# EAGLE design Breakoutboardv1 (EAGLE 6.6.0)

## Sheet 1 of 2
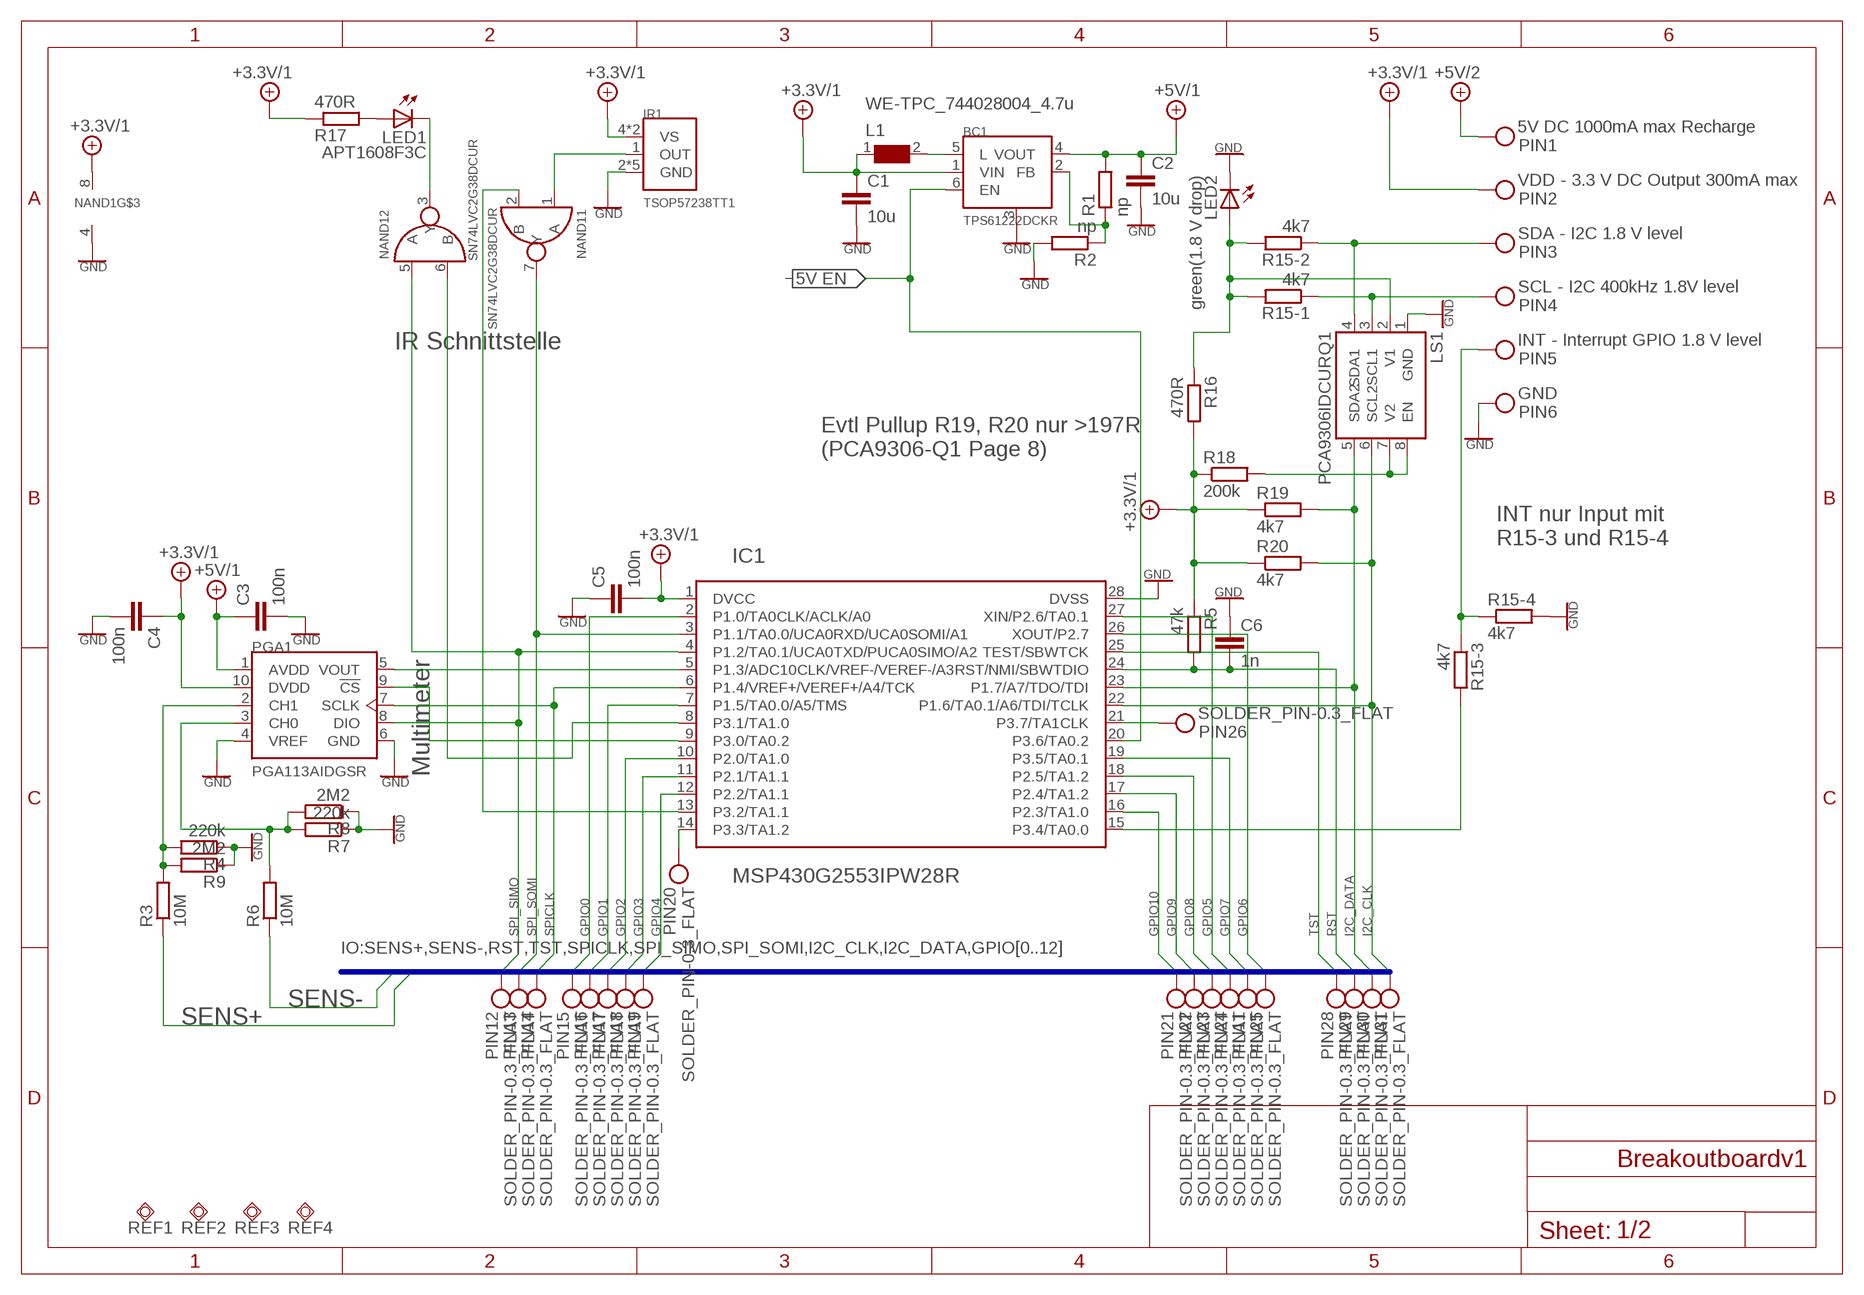
[diagram p0: schematic, sheet 1]

### Parts
BC1  TPS61222DCKR  [SOP65P210X110-6L]
C1  10u  C-EUC0805N  [CAPC2012X95N]
C2  10u  C-EUC0805N  [CAPC2012X95N]
C3  100n  C-EUC0603L  [CAPC1608X90L]
C4  100n  C-EUC0603L  [CAPC1608X90L]
C5  100n  C-EUC0603L  [CAPC1608X90L]
C6  1n  C-EUC0603L  [CAPC1608X90L]
IC1  MSP430G2553IPW28R  [SOP65P640X120-28L]
IR1  TSOP57238TT1  [TSOP572]
L1  WE-TPC_744028004_4.7u  WE-TPC_2811/2813  [WE-TPC_2811/2813]
LED1  APT1608F3C  LED0603  [LED-0603]
LED2  green(1.8 V drop)  LED0603  [LED-0603]
LS1  PCA9306IDCURQ1  [SOP50P310X90-8L]
NAND1  SN74LVC2G38DCUR  [SOP50P310X90-8L]
PGA1  PGA113AIDGSR  [SOP50P490X110-10L]
PIN1  5V DC 1000mA max Recharge  SOLDER_PIN-1.0_FLAT  [SOLDER_PIN_1_FLAT]
PIN2  VDD - 3.3 V DC Output 300mA max  SOLDER_PIN-1.0_FLAT  [SOLDER_PIN_1_FLAT]
PIN3  SDA - I2C 1.8 V level  SOLDER_PIN-1.0_FLAT  [SOLDER_PIN_1_FLAT]
PIN4  SCL - I2C 400kHz 1.8V level  SOLDER_PIN-1.0_FLAT  [SOLDER_PIN_1_FLAT]
PIN5  INT - Interrupt GPIO 1.8 V level  SOLDER_PIN-1.0_FLAT  [SOLDER_PIN_1_FLAT]
PIN6  GND  SOLDER_PIN-1.0_FLAT  [SOLDER_PIN_1_FLAT]
PIN11  SOLDER_PIN-0.3_FLAT  [SOLDER_PIN_0.3_FLAT]
PIN12  SOLDER_PIN-0.3_FLAT  [SOLDER_PIN_0.3_FLAT]
PIN13  SOLDER_PIN-0.3_FLAT  [SOLDER_PIN_0.3_FLAT]
PIN14  SOLDER_PIN-0.3_FLAT  [SOLDER_PIN_0.3_FLAT]
PIN15  SOLDER_PIN-0.3_FLAT  [SOLDER_PIN_0.3_FLAT]
PIN16  SOLDER_PIN-0.3_FLAT  [SOLDER_PIN_0.3_FLAT]
PIN17  SOLDER_PIN-0.3_FLAT  [SOLDER_PIN_0.3_FLAT]
PIN18  SOLDER_PIN-0.3_FLAT  [SOLDER_PIN_0.3_FLAT]
PIN19  SOLDER_PIN-0.3_FLAT  [SOLDER_PIN_0.3_FLAT]
PIN20  SOLDER_PIN-0.3_FLAT  [SOLDER_PIN_0.3_FLAT]
PIN21  SOLDER_PIN-0.3_FLAT  [SOLDER_PIN_0.3_FLAT]
PIN22  SOLDER_PIN-0.3_FLAT  [SOLDER_PIN_0.3_FLAT]
PIN23  SOLDER_PIN-0.3_FLAT  [SOLDER_PIN_0.3_FLAT]
PIN24  SOLDER_PIN-0.3_FLAT  [SOLDER_PIN_0.3_FLAT]
PIN25  SOLDER_PIN-0.3_FLAT  [SOLDER_PIN_0.3_FLAT]
PIN26  SOLDER_PIN-0.3_FLAT  [SOLDER_PIN_0.3_FLAT]
PIN28  SOLDER_PIN-0.3_FLAT  [SOLDER_PIN_0.3_FLAT]
PIN29  SOLDER_PIN-0.3_FLAT  [SOLDER_PIN_0.3_FLAT]
PIN30  SOLDER_PIN-0.3_FLAT  [SOLDER_PIN_0.3_FLAT]
PIN31  SOLDER_PIN-0.3_FLAT  [SOLDER_PIN_0.3_FLAT]
R1  np  R-EU-R0603L  [RESC1608X45L]
R2  np  R-EU-R0603L  [RESC1608X45L]
R3  10M  R-EU-R0603L  [RESC1608X45L]
R4  220k  R-EU-R0603L  [RESC1608X45L]
R5  47k  R-EU-R0603L  [RESC1608X45L]
R6  10M  R-EU-R0603L  [RESC1608X45L]
R7  220k  R-EU-R0603L  [RESC1608X45L]
R8  2M2  R-EU-R0603L  [RESC1608X45L]
R9  2M2  R-EU-R0603L  [RESC1608X45L]
R15  4k7  CTS-74,2C083  [R_ARRAY_742]
R16  470R  R-EU-R0603L  [RESC1608X45L]
R17  470R  R-EU-R0603L  [RESC1608X45L]
R18  200k  R-EU-R0603L  [RESC1608X45L]
R19  4k7  R-EU-R0603L  [RESC1608X45L]
R20  4k7  R-EU-R0603L  [RESC1608X45L]
REF1  PCB-REF-1.27  [PCB-REF]
REF2  PCB-REF-1.27  [PCB-REF]
REF3  PCB-REF-1.27  [PCB-REF]
REF4  PCB-REF-1.27  [PCB-REF]

### Nets
5VEN: BC1.6(EN) IC1.20(P3.6/TA0.2)
+3.3V/1: BC1.1(VIN) C1.1 C4.1 C5.2 IC1.1(DVCC) IR1.4(VS) IR1.5(VS) L1.1 NAND1.8(VDD) PGA1.10(DVDD) PIN2._(PIN) R5.1 R16.2 R17.1 R18.1 R19.1 R20.1 ; also sheet 2
+5V/1: BC1.4(VOUT) C2.1 C3.1 PGA1.1(AVDD) R1.2 ; also sheet 2
+5V/2: PIN1._(PIN) ; also sheet 2
CS_PGA: IC1.9(P3.0/TA0.2) PGA1.9(!CS)
GND: BC1.3(GND) C1.2 C2.2 C3.2 C4.2 C5.1 C6.1 IC1.28(DVSS) IR1.2(GND) IR1.3(GND) IR1.6(GND) IR1.7(GND) IR1.8(GND) LED2.C LS1.1(GND) NAND1.4(GND) PGA1.4(VREF) PGA1.6(GND) PIN6._(PIN) R2.2 R4.1 R7.1 R8.1 R9.1 R15.5 ; also sheet 2
GPIO0: IC1.2(P1.0/TA0CLK/ACLK/A0) PIN15._(PIN) ; also sheet 2
GPIO1: IC1.7(P1.5/TA0.0/A5/TMS) PIN16._(PIN) ; also sheet 2
GPIO2: IC1.10(P2.0/TA1.0) PIN17._(PIN) ; also sheet 2
GPIO3: IC1.11(P2.1/TA1.1) PIN18._(PIN) ; also sheet 2
GPIO4: IC1.12(P2.2/TA1.1) PIN19._(PIN) ; also sheet 2
GPIO5: IC1.27(XIN/P2.6/TA0.1) PIN24._(PIN) ; also sheet 2
GPIO6: IC1.26(XOUT/P2.7) PIN25._(PIN) ; also sheet 2
GPIO7: IC1.19(P3.5/TA0.1) PIN11._(PIN) ; also sheet 2
GPIO8: IC1.18(P2.5/TA1.2) PIN23._(PIN) ; also sheet 2
GPIO9: IC1.17(P2.4/TA1.2) PIN22._(PIN) ; also sheet 2
GPIO10: IC1.16(P2.3/TA1.0) PIN21._(PIN) ; also sheet 2
I2C_CLK: IC1.22(P1.6/TA0.1/A6/TDI/TCLK) LS1.6(SCL2) PIN31._(PIN) R20.2 ; also sheet 2
I2C_DATA: IC1.23(P1.7/A7/TDO/TDI) LS1.5(SDA2) PIN30._(PIN) R19.2 ; also sheet 2
INT_JOLLA: IC1.15(P3.4/TA0.0) R15.6
IR-R_CONT: IC1.13(P3.2/TA1.1) NAND1.2(1:B)
IR-T_CONT: IC1.8(P3.1/TA1.0) NAND1.6(2:B)
N$1: BC1.2(FB) R1.1 R2.1
N$2: BC1.5(L) L1.2
N$4: PGA1.2(CH1) R3.2 R4.2 R9.2
N$6: IC1.14(P3.3/TA1.2) PIN20._(PIN)
N$7: PGA1.3(CH0) R6.2 R7.2 R8.2
N$17: IC1.21(P3.7/TA1CLK) PIN26._(PIN)
N$18: LED1.A R17.2
N$19: PIN5._(PIN) R15.3 R15.4
N$21: LED2.A LS1.2(V1) R15.7 R15.8 R16.1
N$38: IR1.1(OUT) NAND1.1(1:A)
N$39: LED1.C NAND1.3(2:Y)
N$40: LS1.4(SDA1) PIN3._(PIN) R15.2
N$42: LS1.7(V2) LS1.8(EN) R18.2
N$43: LS1.3(SCL1) PIN4._(PIN) R15.1
RST: C6.2 IC1.24(RST/NMI/SBWTDIO) PIN29._(PIN) R5.2 ; also sheet 2
SENS+ [sens]: R3.1 ; also sheet 2
SENS- [sens]: R6.1 ; also sheet 2
SPI_SIMO: IC1.4(P1.2/TA0.1/UCA0TXD/PUCA0SIMO/A2) NAND1.5(2:A) PGA1.8(DIO) PIN12._(PIN) ; also sheet 2
SPI_SOMI: IC1.3(P1.1/TA0.0/UCA0RXD/UCA0SOMI/A1) NAND1.7(1:Y) PIN13._(PIN) ; also sheet 2
SPICLK: IC1.6(P1.4/VREF+/VEREF+/A4/TCK) PGA1.7(SCLK) PIN14._(PIN) ; also sheet 2
TST: IC1.25(TEST/SBWTCK) PIN28._(PIN) ; also sheet 2
VAD_SENSE: IC1.5(P1.3/ADC10CLK/VREF-/VEREF-/A3) PGA1.5(VOUT)
Unconnected: REF1.0(PP) REF2.0(PP) REF3.0(PP) REF4.0(PP)

### Buses
IO:SENS+,SENS-,RST,TST,SPICLK,SPI_SIMO,SPI_SOMI,I2C_CLK,I2C_DATA,GPIO[0..12]

### Notes on the sheet
- IR Schnittstelle
- Evtl Pullup R19, R20 nur >197R
  (PCA9306-Q1 Page 8)
- INT nur Input mit
  R15-3 und R15-4
- Multimeter

## Sheet 2 of 2
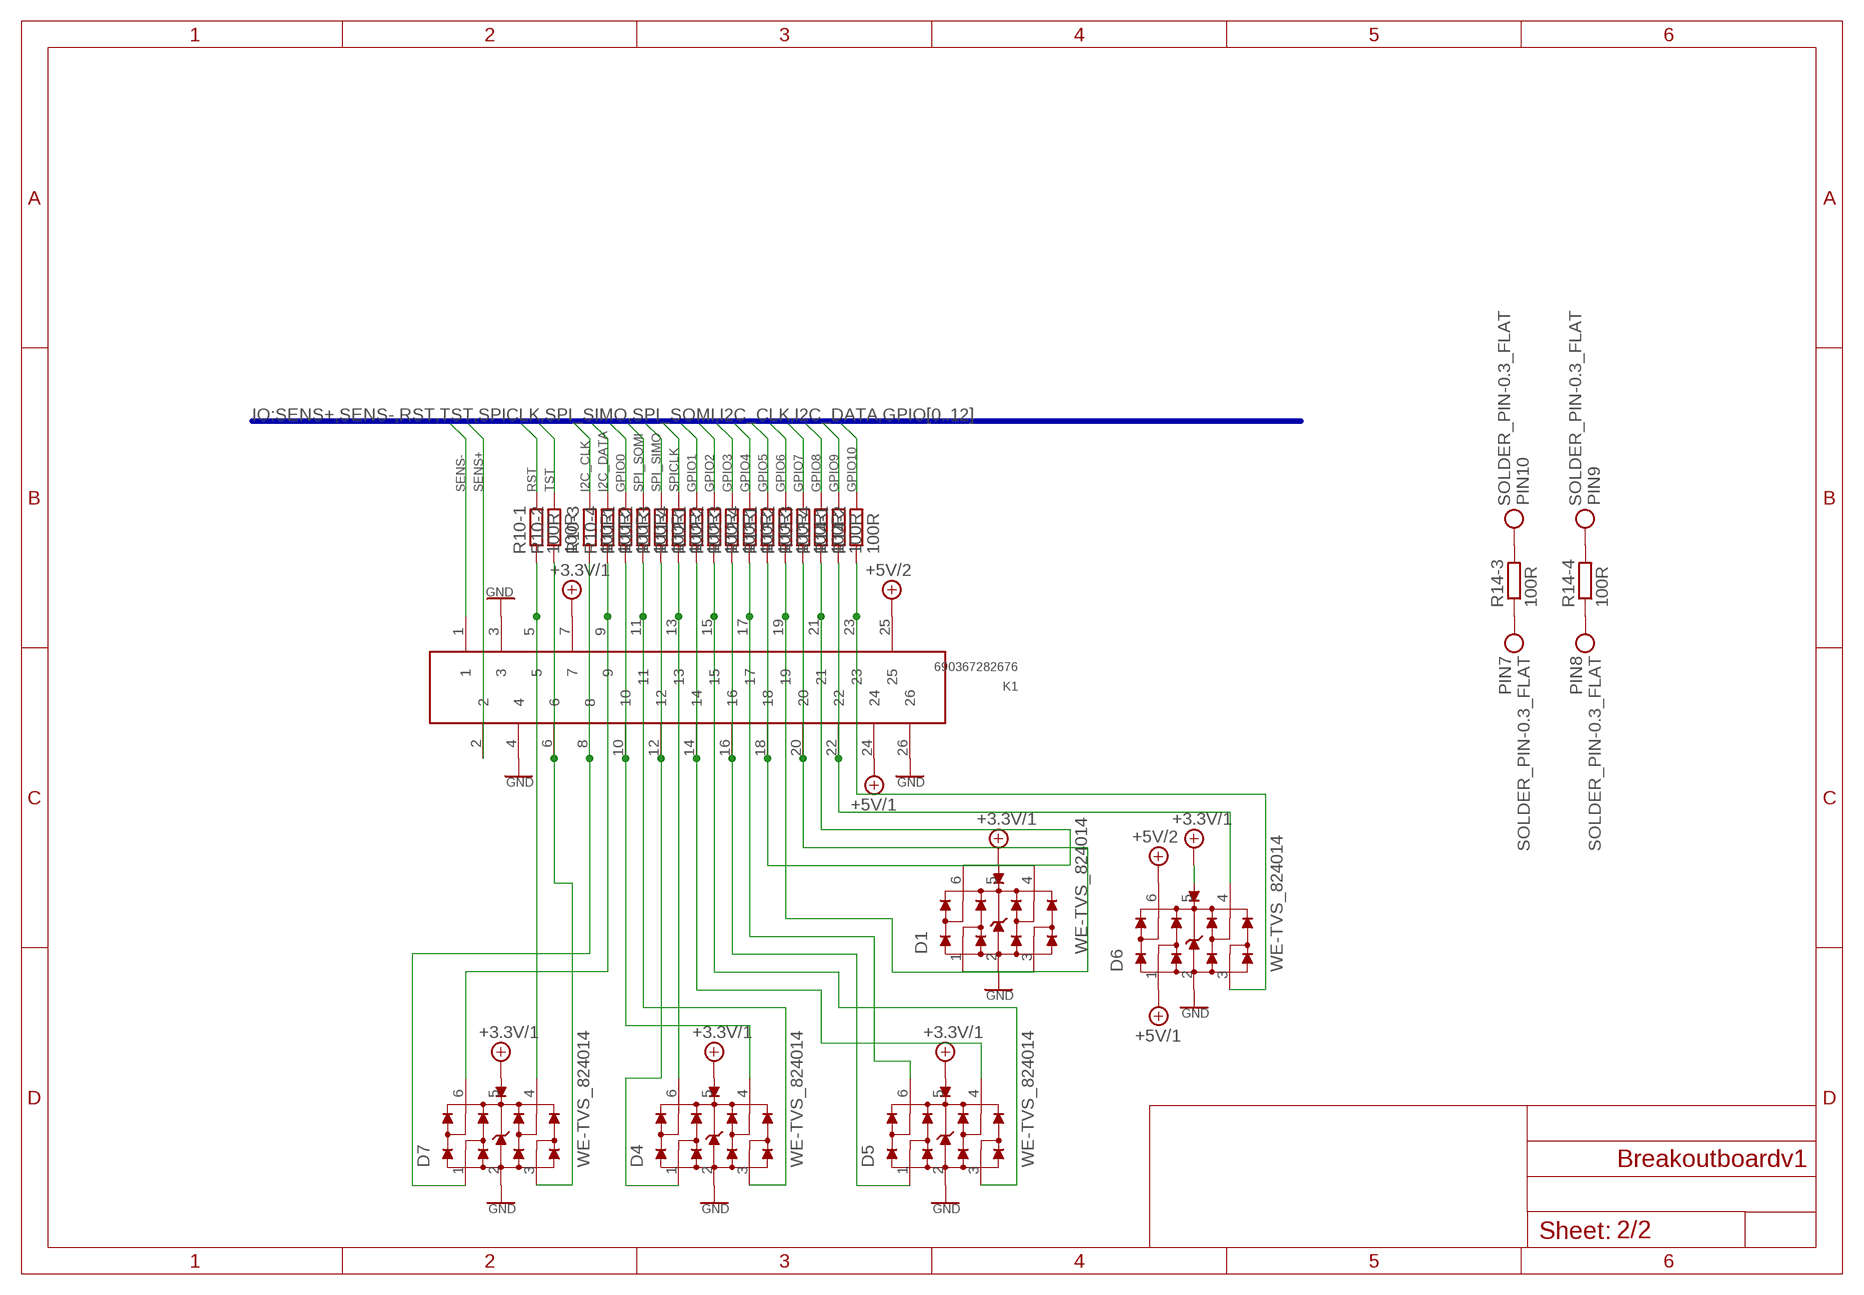
[diagram p1: schematic, sheet 2]

### Parts
D1  WE-TVS_824014  [WE-TVS_SOT23-6L]
D4  WE-TVS_824014  [WE-TVS_SOT23-6L]
D5  WE-TVS_824014  [WE-TVS_SOT23-6L]
D6  WE-TVS_824014  [WE-TVS_SOT23-6L]
D7  WE-TVS_824014  [WE-TVS_SOT23-6L]
K1  690367282676  [690367282676]
PIN7  SOLDER_PIN-0.3_FLAT  [SOLDER_PIN_0.3_FLAT]
PIN8  SOLDER_PIN-0.3_FLAT  [SOLDER_PIN_0.3_FLAT]
PIN9  SOLDER_PIN-0.3_FLAT  [SOLDER_PIN_0.3_FLAT]
PIN10  SOLDER_PIN-0.3_FLAT  [SOLDER_PIN_0.3_FLAT]
R10  100R  CTS-74,2C083  [R_ARRAY_742]
R11  100R  CTS-74,2C083  [R_ARRAY_742]
R12  100R  CTS-74,2C083  [R_ARRAY_742]
R13  100R  CTS-74,2C083  [R_ARRAY_742]
R14  100R  CTS-74,2C083  [R_ARRAY_742]

### Nets
+3.3V/1: D1.5(VDD) D4.5(VDD) D5.5(VDD) D6.5(VDD) D7.5(VDD) K1.7 ; also sheet 1
+5V/1: D6.1 K1.24 ; also sheet 1
+5V/2: D6.6 K1.25 ; also sheet 1
GND: D1.2(GND) D4.2(GND) D5.2(GND) D6.2(GND) D7.2(GND) K1.3 K1.4 K1.26 ; also sheet 1
GPIO0: R11.8 ; also sheet 1
GPIO1: R12.8 ; also sheet 1
GPIO2: R12.7 ; also sheet 1
GPIO3: R12.6 ; also sheet 1
GPIO4: R12.5 ; also sheet 1
GPIO5: R13.8 ; also sheet 1
GPIO6: R13.7 ; also sheet 1
GPIO7: R13.6 ; also sheet 1
GPIO8: R13.5 ; also sheet 1
GPIO9: R14.8 ; also sheet 1
GPIO10: R14.7 ; also sheet 1
I2C_CLK: R10.6 ; also sheet 1
I2C_DATA: R10.5 ; also sheet 1
N$8: D7.1 K1.8 R10.3
N$9: D7.6 K1.9 R10.4
N$10: D4.4 K1.10 R11.1
N$12: D4.1 K1.12 R11.3
N$13: D4.6 K1.13 R11.4
N$14: D5.4 K1.14 R12.1
N$15: D5.3 K1.15 R12.2
N$16: D5.1 K1.16 R12.3
N$24: D7.4 K1.5 R10.1
N$25: D7.3 K1.6 R10.2
N$26: D4.3 K1.11 R11.2
N$27: D5.6 K1.17 R12.4
N$28: D1.4 K1.18 R13.1
N$29: D1.3 K1.19 R13.2
N$30: D1.1 K1.20 R13.3
N$31: D1.6 K1.21 R13.4
N$32: D6.4 K1.22 R14.1
N$33: D6.3 K1.23 R14.2
N$34: PIN7._(PIN) R14.3
N$35: PIN8._(PIN) R14.4
N$36: PIN9._(PIN) R14.5
N$37: PIN10._(PIN) R14.6
RST: R10.8 ; also sheet 1
SENS+ [sens]: K1.2 ; also sheet 1
SENS- [sens]: K1.1 ; also sheet 1
SPI_SIMO: R11.6 ; also sheet 1
SPI_SOMI: R11.7 ; also sheet 1
SPICLK: R11.5 ; also sheet 1
TST: R10.7 ; also sheet 1

### Buses
IO:SENS+,SENS-,RST,TST,SPICLK,SPI_SIMO,SPI_SOMI,I2C_CLK,I2C_DATA,GPIO[0..12]

## Library data of the parts
BC1 = MasterPhonebot:TPS61222?*: TPS61222 Description The TPS6122x family devices provide a power-supply solution for products powered by either a single-cell, two-cell, or three-cell alkaline, NiCd or NiMH, or one-cell Li-Ion or Li-polymer battery. Possible output currents depend on the input-to-output voltage ratio. The boost converter is based on a hysteretic controller topology using synchronous rectification to obtain maximum efficiency at minimal quiescent currents. The output voltage of the adjustable version can be programmed by an external resistor divider, or is set internally to a fixed output voltage. The converter can be switched off by a featured enable pin. While being switched off, battery drain is minimized. The device is offered in a 6-pin SC-70 package (DCK) measuring 2 mm × 2 mm to enable small circuit layout size. Features Up to 95% Efficiency at Typical Operating Conditions 5.5 µA Quiescent Current Startup Into Load at 0.7 V Input Voltage Operating Input Voltage from 0.7 V to 5.5 V Pass-Through Function during Shutdown Minimum Switching Current 200 mA Protections: Output Overvoltage Overtemperature Input Undervoltage Lockout Adjustable Output Voltage from 1.8 V to 6 V Fixed Output Voltage Versions Small 6-pin SC-70 Package Details see: Datasheet <http://www.ti.com/lit/ds/symlink/tps61222.pdf> www.ti.com <http://www.ti.com/product/TPS61222> Created: L.Lischke 2015-03-21 (c) KK-Prime Engineering GmbH; SPQ: 3000
C1-C6 = MasterPhonebot:C-EU: Capacitor, European Symbol
D1 D4-D7 = MasterPhonebot:WE-TVS_824014: TVS Diode Array WE-TVS, Super Speed Serie - Low capazity - No leakage current - Low clamping voltage - high ESD voltage protection -- SATA -- DisplayPort -- DVI -- HDMI <http://katalog.we-online.de/media/images/eisos/VarTVS_highspeed_pf2.jpg.jpg> Details see: http://katalog.we-online.de/en/pbs/WE-TVS_High_Speed? Updated by Dan Xu 2014-07-11 2014 (C) Würth Elektronik
IC1 = MasterPhonebot:MSP430G2*53?28R: MSP430G2x53 Description The Texas Instruments MSP430 family of ultra-low-power microcontrollers consists of several devices featuring different sets of peripherals targeted for various applications. The architecture, combined with five low-power modes, is optimized to achieve extended battery life in portable measurement applications. The device features a powerful 16-bit RISC CPU, 16-bit registers, and constant generators that contribute to maximum code efficiency. The digitally controlled oscillator (DCO) allows wake-up from low-power modes to active mode in less than 1 µs. The MSP430G2x13 and MSP430G2x53 series are ultra-low-power mixed signal microcontrollers with built-in 16-bit timers, up to 24 I/O capacitive-touch enabled pins, a versatile analog comparator, and built-in communication capability using the universal serial communication interface. In addition the MSP430G2x53 family members have a 10-bit analog-to-digital (A/D) converter. For configuration details see . Typical applications include low-cost sensor systems that capture analog signals, convert them to digital values, and then process the data for display or for transmission to a host system. Features Low Supply-Voltage Range: 1.8 V to 3.6 V Ultra-Low Power Consumption Active Mode: 230 µA at 1 MHz, 2.2 V Standby Mode: 0.5 µA Off Mode (RAM Retention): 0.1 µA Five Power-Saving Modes Ultra-Fast Wake-Up From Standby Mode in Less Than 1 µs 16-Bit RISC Architecture, 62.5-ns Instruction Cycle Time Basic Clock Module Configurations Internal Frequencies up to 16 MHz With Four Calibrated Frequency Internal Very-Low-Power Low-Frequency (LF) Oscillator 32-kHz Crystal External Digital Clock Source Two 16-Bit Timer_A With Three Capture/Compare Registers Up to 24 Capacitive-Touch Enabled I/O Pins Universal Serial Communication Interface (USCI) Enhanced UART Supporting Auto Baudrate Detection (LIN) IrDA Encoder and Decoder Synchronous SPI I2C™ On-Chip Comparator for Analog Signal Compare Function or Slope Analog-to-Digital (A/D) Conversion 10-Bit 200-ksps Analog-to-Digital (A/D) Converter With Internal Reference, Sample-and-Hold, and Autoscan Brownout Detector Serial Onboard Programming, No External Programming Voltage Needed, Programmable Code Protection by Security Fuse On-Chip Emulation Logic With Spy-Bi-Wire Interface Package Options TSSOP: 20 Pin, 28 Pin PDIP: 20 Pin QFN: 32 Pin Details see: Datasheet <http://www.ti.com/lit/ds/symlink/msp430g2553.pdf> General Information: www.ti.com <http://www.ti.com/product/msp430g2553> Created: L.Lischke 2015-03-21 (c) KK-Prime Engineering GmbH
IR1 = MasterPhonebot:TSOP57?*: IR-Receiver TSOP57xxxx Description IR Receiver Modules for Remote Control Systems Features Height of 0.8 mm ± 75° half angle sensitivity Low supply current Details see: Datasheet <http://www.vishay.com/docs/82434/tsop572.pdf> Further Details: www.vishay.com <http://www.vishay.com/product?docid=82646#geninf> Created: L.Lischke 2015-03-22 (c) KK-Prime-Engineering GmbH
K1 = MasterPhonebot:690367282676: WR-MM Female SMT Connector with Polarization, 26 Pins=>Code : Con_BTB_MM_Female_SMT_690367282676 <http://katalog.we-online.de/media/thumbs2/eican/thb_Con_BTB_MM_Female_SMT_69036728xx76_pf2.jpg> Details see: http://katalog.we-online.de/en/em/6903_6728_xx_76 Created 2014-06-04, Karrer Zheng 2014 (C) Würth Elektronik
L1 = MasterPhonebot:WE-TPC: Shielded Tiny Power Inductor WE-TPC - Extremely flat power inductor - High current capability - High reliability and perfect soldering characteristics because of integrated soldering pad - magnetically shielded -- Portable power like PDA, digital camera, PCMICA-cards and displays -- DC/DC-converter -- Recommended for switching regulator IC's from Linear Technology, National Semiconductor, Texas Instruments and Fairchild Semiconductor <http://katalog.we-online.de/media/images/eisos/IndTPC_pf2.jpg> Details see: http://katalog.we-online.de/en/pbs/WE-TPC? Updated by Dan Xu 2014-07-11 2014 (C) Würth Elektronik
LED1 LED2 = MasterPhonebot:LED: LEDs Standard schematic elements and footprints for 5mm, 3mm, 1206, and 0603 sized LEDs. 5mm - Spark Fun Electronics SKU : COM-00529 (and others)
LS1 = MasterPhonebot:PCA9306*?: I2C Levelshifter PCA9306-Q1 Description This dual bidirectional I2C and SMBus voltage-level translator, with an enable (EN) input, is operational from 1.2-V to 3.3-V VREF1 and 1.8-V to 5.5-V VREF2. The PCA9306 allows bidirectional voltage translations between 1.2 V and 5 V, without the use of a direction pin. The low ON-state resistance (ron) of the switch allows connections to be made with minimal propagation delay. When EN is high, the translator switch is ON, and the SCL1 and SDA1 I/O are connected to the SCL2 and SDA2 I/O, respectively, allowing bidirectional data flow between ports. When EN is low, the translator switch is off, and a high-impedance state exists between ports. In I2C applications, the bus capacitance limit of 400 pF restricts the number of devices and bus length. Using the PCA9306 enables the system designer to isolate two halves of a bus; thus, more I2C devices or longer trace length can be accommodated. The PCA9306 also can be used to run two buses, one at 400-kHz operating frequency and the other at 100-kHz operating frequency. If the two buses are operating at different frequencies, the 100-kHz bus must be isolated when the 400-kHz operation of the other bus is required. If the master is running at 400 kHz, the maximum system operating frequency may be less than 400 kHz because of the delays added by the repeater. As with the standard I2C system, pullup resistors are required to provide the logic high levels on the translator's bus. The PCA9306 has a standard open-collector configuration of the I2C bus. The size of these pullup resistors depends on the system, but each side of the repeater must have a pullup resistor. The device is designed to work with standard-mode and fast-mode I2C devices, in addition to SMBus devices. Standard-mode I2C devices only specify 3 mA in a generic I2C system where standard-mode devices and multiple masters are possible. Under certain conditions, high termination currents can be used. When the SDA1 or SDA2 port is low, the clamp is in the ON state, and a low resistance connection exists between the SDA1 and SDA2 ports. Assuming the higher voltage is on the SDA2 port when the SDA2 port is high, the voltage on the SDA1 port is limited to the voltage set by VREF1. When the SDA1 port is high, the SDA2 port is pulled to the drain pullup supply voltage (VDPU) by the pullup resistors. This functionality allows a seamless translation between higher and lower voltages selected by the user, without the need for directional control. The SCL1/SCL2 channel also functions as the SDA1/SDA2 channel. All channels have the same electrical characteristics, and there is minimal deviation from one output to another in voltage or propagation delay. This is a benefit over discrete transistor voltage translation solutions, since the fabrication of the switch is symmetrical. The translator provides excellent ESD protection to lower-voltage devices and at the same time protects less ESD-resistant devices. Features Qualified for Automotive Applications AEC-Q100 Qualified With the Following Results: Device Temperature Grade 2: –40°C to 105°C Device HBM ESD Classification Level H2 Device CDM ESD Classification Level C4B 2-Bit Bidirectional Translator for SDA and SCL Lines in Mixed-Mode I2C Applications I2C and SMBus Compatible Less Than 1.5-ns Maximum Propagation Delay to Accommodate Standard-Mode and Fast-Mode I2C Devices and Multiple Masters Allows Voltage-Level Translation Between 1.2-V VREF1 and 1.8-V, 2.5-V, 3.3-V, or 5-V VREF2 1.8-V VREF1 and 2.5-V, 3.3-V or 5-V VREF2 2.5-V VREF1 and 3.3-V or 5-V VREF2 3.3-V VREF1 and 5-V VREF2 Provides Bidirectional Voltage Translation With No Direction Pin Low 3.5-Ω ON-State Connection Between Input and Output Ports Provides Less Signal Distortion Open-Drain I2C I/O Ports (SCL1, SDA1, SCL2, and SDA2) 5-V Tolerant I2C I/O Ports to Support Mixed-Mode Signal Operation High-Impedance SCL1, SDA1, SCL2, and SDA2 Pins for EN = Low Lock-Up-Free Operation for Isolation When EN = Low Flow-Through Pinout for Ease of Printed Circuit Board Trace Routing Latch-Up Performance Exceeds 100 mA Per JESD 78, Class II ESD Protection Exceeds JESD 22 2000-V Human-Body Model (A114-A) 200-V Machine Model (A115-A) 1000-V Charged-Device Model (C101) Details see: Datasheet <http://www.ti.com/lit/ds/symlink/pca9306-q1.pdf> General Information: www.ti.com <http://www.ti.com/product/pca9306-q1> Created: L.Lischke 2015-03-23 (c) KK-Prime Engineering GmbH; OPTEMP: -40 to 85 °C
NAND1 = MasterPhonebot:SN74LVC2G38?*: SN74LVC2G38 Description The SN74LVC2G38 is designed for 1.65-V to 5.5-V VCC operation. This device is a dual two-input NAND buffer gate with open-drain outputs. It performs the Boolean function Y = A • B or Y = A + B in positive logic. NanoFree™ package technology is a major breakthrough in IC packaging concepts, using the die as the package. This device is fully specified for partial-power-down applications using Ioff. The Ioff circuitry disables the outputs, preventing damaging current backflow through the device when it is powered down. Features Available in the Texas Instruments NanoFree Package Supports 5-V VCC Operation Inputs Accept Voltages to 5.5 V Max tpd of 4 ns at 3.3 V Low Power Consumption, 10-μA Max ICC ±24-mA Output Drive at 3.3 V Typical VOLP (Output Ground Bounce) <0.8 V at VCC = 3.3 V, TA = 25°C Typical VOHV (Output VOH Undershoot) >2 V at VCC = 3.3 V, TA = 25°C Ioff Supports Live insertion, Partial-Power-Down Mode Operation and Back Drive Protection Latch-Up Performance Exceeds 100 mA Per JESD 78, Class II ESD Protection Exceeds JESD 22 2000-V Human-Body Model (A114-A) 200-V Machine Model (A115-A) 1000-V Charged-Device Model (C101) Details see: Datasheet <http://www.ti.com/lit/ds/symlink/sn74lvc2g38.pdf> General Details: www.ti.com <http://www.ti.com/product/sn74lvc2g38> Created: L.Lischke 2015-03-23 (c) KK-Prime Engineering GmbH
PGA1 = MasterPhonebot:PGA11: PGA113 Description The PGA112 and PGA113 (binary/scope gains) offer two analog inputs, a three-pin SPI interface, and software shutdown in an MSOP-10 package. The PGA116 and PGA117 (binary/scope gains) offer 10 analog inputs, a four-pin SPI interface with daisy-chain capability, and hardware and software shutdown in a TSSOP-20 package. All versions provide internal calibration channels for system-level calibration. The channels are tied to GND, 0.9VCAL, 0.1VCAL, and VREF, respectively. VCAL, an external voltage connected to Channel 0, is used as the system calibration reference. Binary gains are: 1, 2, 4, 8, 16, 32, 64, and 128; scope gains are: 1, 2, 5, 10, 20, 50, 100, and 200. Features Rail-to-Rail Input/Output Offset: 25µV (typ), 100µV (max) Zerø-Drift: 0.35µV/°C (typ), 1.2µV/°C (max) Low Noise: 12nV/√Hz Input Offset Current: ±5nA max (+25°C) Gain Error: 0.1% max (G ≤ 32), 0.3% max (G > 32) Binary Gains: 1, 2, 4, 8, 16, 32, 64, 128(PGA112, PGA116) Scope Gains: 1, 2, 5, 10, 20, 50, 100, 200 (PGA113, PGA117) Gain Switching Time: 200ns Two Channel MUX: PGA112, PGA113 10 Channel MUX: PGA116, PGA117 Four Internal Calibration Channels Amplifier Optimized for Driving CDAC ADCs Output Swing: 50mV to Supply Rails AVDD and DVDD for Mixed Voltage Systems IQ = 1.1mA (typ) Software/Hardware Shutdown: IQ ≤ 4µA (typ) Temperature Range: -40°C to +125°C SPI Interface (10MHz) with Daisy-Chain Capability APPLICATIONS Remote e-Meter Reading Automatic Gain Control Portable Data Acquisition PC-Based Signal Acquisition Systems Test and Measurement Programmable Logic Controllers Battery-Powered Instruments Handheld Test Equipment Details see: Datasheet <http://www.ti.com/lit/ds/symlink/pga113.pdf> General Informations: www.ti.com <http://www.ti.com/product/PGA113> Created: L.Lischke 2015-03-21 (c) KK-Prime Engineering GmbH; GAINS: Scope
PIN1-PIN26 PIN28-PIN31 = MasterPhonebot:SOLDER_PIN: Simple Solder pin Created G. Klenner, 2013 (C) K&K Prime Engineering GmbH
R1-R9 R16-R20 = MasterPhonebot:R-EU: Resistor, European Symbol
R10-R15 = MasterPhonebot:CTS-74: Chip Resistor Arrays Series 74x Features Low Cost Thick Film Technology High Density Packaging Low Profile; can be used in PCMCIA cards Leadless Surface Mount Construction Concave or Convex Terminations Solder Coated Nickel Barrier Pads Isolated and Bussed Circuits Resistor Arrays Require Fewer Placements Than Discrete Components Tape and Reel Packaging RoHS Compliant in Accordance with EU Directive 2005/95/EC View All Features in Datasheet <http://www.ctscorp.com/components/Datasheets/CTSChipArrayDs.pdf> Details see: www.ctscorp.com Created A. Bachmaier, K&K Prime Engineering GmbH (c) 2011; 0_HOUSING: 1206; 0_MANUF: CTS; 1_DISTR: Digi-Key; 1_PN: 742C083103JPCT-ND
REF1-REF4 = MasterPhonebot:PCB-REF: reference point for PCB population Created G. Klenner, 2011-09-21 (c) K&K Prime Engineering GmbH

## Net classes
1 sens: width 0.3 mm, drill 0.6 mm, clearance 1 mm

## Board
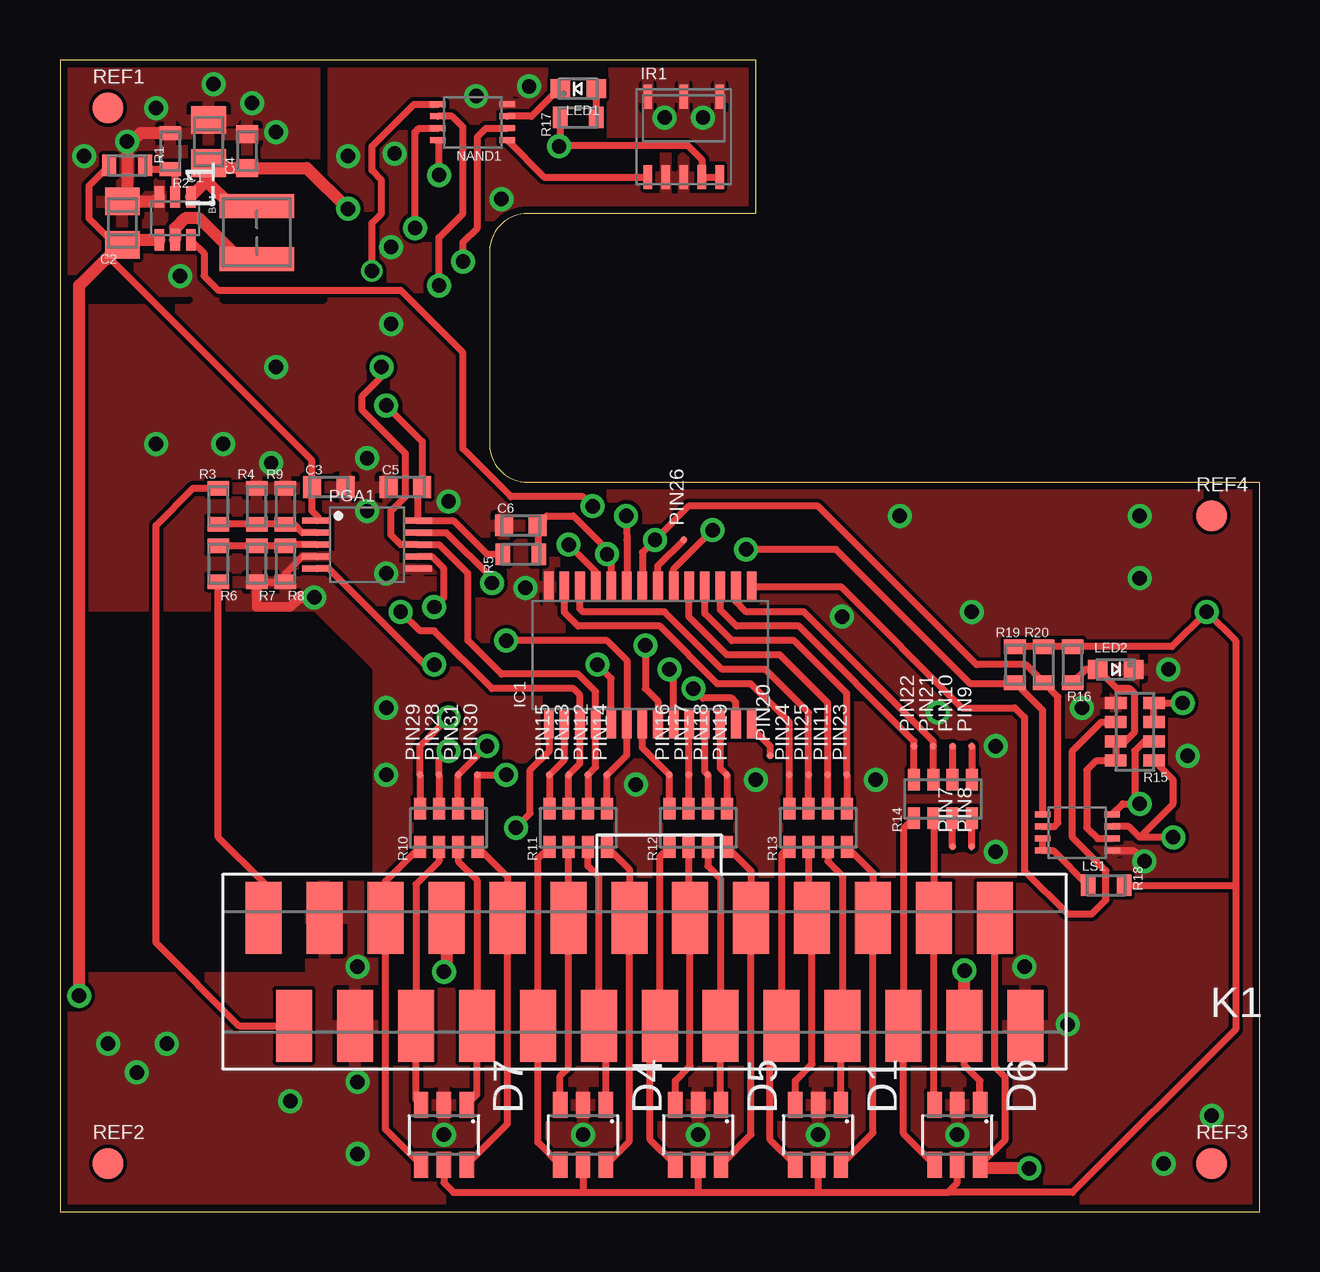
[diagram p2: board, top side]
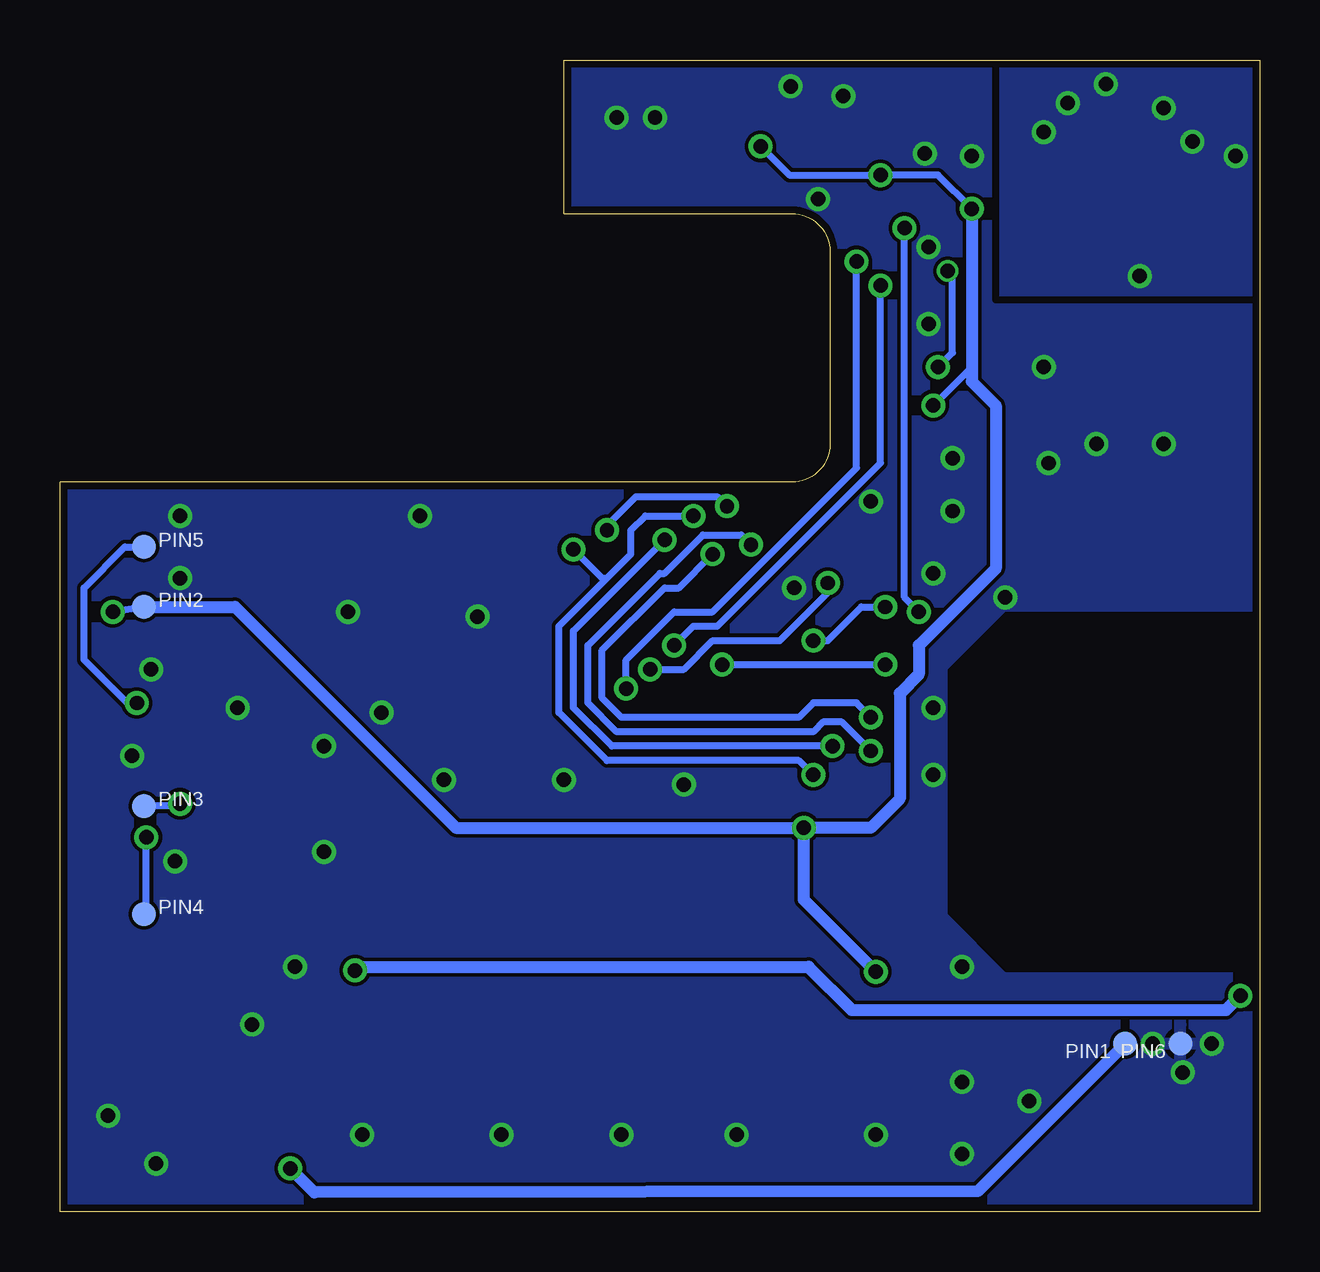
[diagram p3: board, bottom side, seen from below]

Size 50 x 48 mm. Coordinates in mm from the lower left corner, seen from the top.
Outline: 0,0 50,0 50,30.4 19.5,30.4 arc-90 17.9,32 17.9,40 arc-90 19.5,41.6 29,41.6 29,48 0,48 0,0
Copper layers (1*16): Top 0.035mm / dielectric 0.5mm / Bottom 0.035mm
Design rules "Eagle-DRU - 1109 - LeitOn - 01 and 02 layers KK *": minimum track width 0.15mm, minimum drill 0.3mm, track to track 0.15mm, track to pad 0.15mm, pad to pad 0.15mm, via to via 0.15mm, smd to smd 0.15mm, copper to edge 0.3mm, drill to drill 0.3mm, minimum pad ring 0.15mm, minimum via ring 0.15mm, stop-mask expansion 0.05mm, vias tented up to drill 0.3mm, thermal gap 0.2mm
tRestrict: area 1,10 to 13,25; 4 lines
bRestrict: area 1,10 to 13,25; 4 lines

### Footprints (pad centres in the part's own frame; a part is rotated, then mirrored left to right if it is on the bottom)
SOP65P210X110-6L = smd 0.9 x 0.4: 1 -0.9,0.65; 2 -0.9,0; 3 -0.9,-0.65; 4 0.9,-0.65; 5 0.9,0; 6 0.9,0.65
CAPC2012X95N = smd 1.15 x 1.45: 1 0.9,0; 2 -0.9,0
CAPC1608X90L = smd 0.75 x 0.9: 1 -0.7,0; 2 0.7,0
WE-TVS_SOT23-6L = smd 0.6 x 1.1: 1 -0.95,-1.25; 2 0,-1.25; 3 0.95,-1.25; 4 0.95,1.25; 5 0,1.25; 6 -0.95,1.25
SOP65P640X120-28L = smd 1.25 x 0.4: 1 -2.85,4.225; 2 -2.85,3.575; 3 -2.85,2.925; 4 -2.85,2.275; 5 -2.85,1.625; 6 -2.85,0.975; 7 -2.85,0.325; 8 -2.85,-0.325; 9 -2.85,-0.975; 10 -2.85,-1.625; 11 -2.85,-2.275; 12 -2.85,-2.925; 13 -2.85,-3.575; 14 -2.85,-4.225; 15 2.85,-4.225; 16 2.85,-3.575; 17 2.85,-2.925; 18 2.85,-2.275; 19 2.85,-1.625; 20 2.85,-0.975; 21 2.85,-0.325; 22 2.85,0.325; 23 2.85,0.975; 24 2.85,1.625; 25 2.85,2.275; 26 2.85,2.925; 27 2.85,3.575; 28 2.85,4.225
TSOP572 = smd 0.35 x 1: 1 -1.5,-1.675; 2 -0.75,-1.675; 3 0,-1.675; 4 0.75,-1.675; 5 1.5,-1.675; 6 1.5,1.675; 7 0,1.675; 8 -1.5,1.675
690367282676 = smd 1.5 x 3: 1 16.51,-2.25; 2 15.24,2.25; 3 13.97,-2.25; 4 12.7,2.25; 5 11.43,-2.25; 6 10.16,2.25; 7 8.89,-2.25; 8 7.62,2.25; 9 6.35,-2.25; 10 5.08,2.25; 11 3.81,-2.25; 12 2.54,2.25; 13 1.27,-2.25; 14 0,2.25; 15 -1.27,-2.25; 16 -2.54,2.25; 17 -3.81,-2.25; 18 -5.08,2.25; 19 -6.35,-2.25; 20 -7.62,2.25; 21 -8.89,-2.25; 22 -10.16,2.25; 23 -11.43,-2.25; 24 -12.7,2.25; 25 -13.97,-2.25; 26 -15.24,2.25
WE-TPC_2811/2813 = smd 1 x 3.1: 1 -1.1,0; 2 1.1,0
LED-0603 = smd 0.8 x 0.8: A 0,-0.75; C 0,0.75
SOP50P310X90-8L = smd 0.65 x 0.25: 1 -1.45,0.75; 2 -1.45,0.25; 3 -1.45,-0.25; 4 -1.45,-0.75; 5 1.45,-0.75; 6 1.45,-0.25; 7 1.45,0.25; 8 1.45,0.75
SOP50P490X110-10L = smd 1.2 x 0.25: 1 -2.1,1; 2 -2.1,0.5; 3 -2.1,0; 4 -2.1,-0.5; 5 -2.1,-1; 6 2.1,-1; 7 2.1,-0.5; 8 2.1,0; 9 2.1,0.5; 10 2.1,1
SOLDER_PIN_1_FLAT = smd 1 x 1: _ 0,0
SOLDER_PIN_0.3_FLAT = smd 0.3 x 0.3: _ 0,0
RESC1608X45L = smd 0.6 x 0.9: 1 -0.75,0; 2 0.75,0
R_ARRAY_742 = smd 0.5 x 0.9: 1 -1.2,-0.8; 2 -0.4,-0.8; 3 0.4,-0.8; 4 1.2,-0.8; 5 1.2,0.8; 6 0.4,0.8; 7 -0.4,0.8; 8 -1.2,0.8
PCB-REF = smd 1.27 x 1.27: 0 0,0

### Placement (x,y rotation side)
BC1  4.8,41.4 270 top
C1  6.2,44.6 270 top
C2  2.6,41.2 270 top
C3  11.2,30.2 0 top
C4  7.8,44.2 90 top
C5  14.4,30.2 0 top
C6  19.2,28.6 0 top
D1  31.6,3.2 180 top
D4  21.8,3.2 180 top
D5  26.6,3.2 180 top
D6  37.4,3.2 180 top
D7  16,3.2 180 top
IC1  24.6,23.2 90 top
IR1  26,44.8 0 top
K1  25,10 180 top
L1  8.2,40.8 270 top
LED1  21.6,46.8 90 top
LED2  44,22.6 270 top
LS1  42.4,15.8 180 top
NAND1  17.2,45.4 180 top
PGA1  12.8,27.8 0 top
PIN1  5.6,7 90 bottom
PIN2  46.5,25.2 270 bottom
PIN3  46.5,16.9 270 bottom
PIN4  46.5,12.4 270 bottom
PIN5  46.5,27.7 270 bottom
PIN6  3.3,7 90 bottom
PIN7  37.2,15.2 0 top
PIN8  38,15.2 0 top
PIN9  38,19.4 0 top
PIN10  37.2,19.4 0 top
PIN11  32,18.2 0 top
PIN12  22,18.2 0 top
PIN13  21.2,18.2 0 top
PIN14  22.8,18.2 0 top
PIN15  20.4,18.2 0 top
PIN16  25.4,18.2 0 top
PIN17  26.2,18.2 0 top
PIN18  27,18.2 0 top
PIN19  27.8,18.2 0 top
PIN20  29.6,19 0 top
PIN21  36.4,19.4 0 top
PIN22  35.6,19.4 0 top
PIN23  32.8,18.2 0 top
PIN24  30.4,18.2 0 top
PIN25  31.2,18.2 0 top
PIN26  26,28 0 top
PIN28  15.8,18.2 0 top
PIN29  15,18.2 0 top
PIN30  17.4,18.2 0 top
PIN31  16.6,18.2 0 top
R1  2.8,43.6 180 top
R2  4.6,44.2 90 top
R3  6.6,29.4 270 top
R4  8.2,29.4 270 top
R5  19.2,27.4 0 top
R6  6.6,27 90 top
R7  8.2,27 90 top
R8  9.4,27 90 top
R9  9.4,29.4 270 top
R10  16.2,16 0 top
R11  21.6,16 0 top
R12  26.6,16 0 top
R13  31.6,16 0 top
R14  36.8,17.2 0 top
R15  44.8,20 90 top
R16  42.2,22.8 90 top
R17  21.6,45.6 0 top
R18  43.6,13.6 180 top
R19  39.8,22.8 270 top
R20  41,22.8 270 top
REF1  2,46 0 top
REF2  2,2 0 top
REF3  48,2 0 top
REF4  48,29 0 top

### Tracks (layer width: path | path; a pad name or v marks a point on that pad's centre or on a via)
5VEN  (via drill 0.6 pad 1)
  Top 0.3: IC1.20 25.57,26.77 v27.2,28.4 | v22.2,29.4 21.8,29.8 18.8,29.8 16.8,31.8 16.8,35.8 14.2,38.4 6.6,38.4 6,39 6,39.95 BC1.6
  Bottom 0.3: v27.2,28.4 27.2,28.6 26,29.8 22.6,29.8 v22.2,29.4
+3.3V/1  (via drill 0.6 pad 1)
  Top 0.3: D7.5 16,1.2 16.4,0.8 21.8,0.8 | 21.8,0.8 26.6,0.8 | 26.6,0.8 31.6,0.8 | 31.6,0.8 37,0.8 | 37,0.8 37.4,1.2 D6.5 | D4.5 21.8,0.8 | D5.5 26.6,0.8 | D1.5 31.6,0.8 | 49,13.6 49,23.8 v47.8,25 46.35,23.55 R16.2 R20.1 R19.1 | 49,13.6 49,7.6 42.2,0.8 37,0.8 | R5.1 17.8,27.4 16.4,28.8 PGA1.10 14.9,30 C5.2 15.1,32.1 v13.6,33.6 | v19,16 19.6,16.6 19.6,18.4 20.4,19.2 20.4,20.32 IC1.1 | 16.11,10.11 v16,10 | v15.8,43.2 15.8,44.6 NAND1.8 | R17.1 20.85,44.45 | 20.85,44.45 v20.8,44.4 | 20.85,44.45 26.15,44.45 26.75,43.85 IR1.4 IR1.5 | R18.1 49,13.6
  Top 0.5: 6.1,42.95 C1.1 6.4,43.5 C4.1 10.3,43.5 v12,41.8 | 6.1,42.95 BC1.1 | L1.1 7.15,41.9 6.1,42.95 | K1.7 16.11,10.11
  Bottom 0.3: PIN2._ v47.8,25 | v12,41.8 13.4,43.2 v15.8,43.2 19.6,43.2 v20.8,44.4 | v13.6,33.6 12,35.2 12,34.8 12,34.5
  Bottom 0.5: PIN2._ 42.7,25.2 33.5,16 v19,16 | v16,10 19,13 v19,16 | v12,41.8 12,34.8 12,34.6 11,33.6 11,26.8 14.2,23.6 14.2,22.4 15,21.6 15,17.2 16.2,16 v19,16
+5V/1  (via drill 0.6 pad 1)
  Top 0.3: R1.2 1.2,42.75 1.2,41.4 2.3,40.3 C2.1 | D6.1 38.35,5.45 37.7,6.1 K1.24 | PGA1.1 10.8,28.9 10.5,29.2 C3.1 10.5,31.3 2,39.8
  Top 0.5: BC1.4 2.8,40.5 C2.1 2,39.7 2,39.8 0.8,38.6 v0.8,9 | K1.24 v37.7,10.05
  Bottom 0.5: v37.7,10.05 37.55,10.2 18.8,10.2 17,8.4 1.4,8.4 v0.8,9
+5V/2  (via drill 0.6 pad 1)
  Top 0.3: D6.6 39.4,3 39.4,5.6 38.97,6.03 K1.25
  Top 0.5: v40.4,1.8 38.5,1.8 D6.6
  Bottom 0.5: PIN1._ 11.75,0.85 39.4,0.8 v40.4,1.8
CS_PGA  (via drill 0.6 pad 1)
  Top 0.3: IC1.9 25.57,22.38 v25.4,22.6 | v18,26.2 18,26.4 16.1,28.3 PGA1.9
  Bottom 0.3: v25.4,22.6 24,22.6 22.8,23.8 20,23.8 18,25.8 v18,26.2
GND  (via drill 0.6 pad 1)
  Top 0.3: PGA1.4 10.1,27.3 9.4,26.6 R8.1 R7.1 | LS1.1 44.75,15.05 v45.2,14.6
  Top 0.4: 10,25.6 9.6,25.2 8.2,25.2 8.2,26.2
  Top 0.5: BC1.3 3.95,42.1 C2.2 2.8,42.3 2.8,44.4 3.35,44.95 R2.2 | v10.6,25.6 10,25.6
  other vias: 4.45,7 3.2,5.8 2,7 16,3.2 21.8,3.2 26.6,3.2 31.6,3.2 37.4,3.2 13.6,26.6 12.4,5.4 48,4 46,2 24,17.8 29,18 34,18 13.6,18.2 6.8,32 13.6,21 4,32 9,35.2 12.8,29.2 35,29 45,29 12.8,31.4 16.2,29.6 19.4,26 25.2,45.6 26.8,45.6 18.4,42.2 12,44 9,45 4,46 1,44 5,39 6.4,47 8,46.2 2.8,44.6 12.4,10.2 40.2,10.2 42,7.8 46.2,22.6 39,19.4 42.6,21 38,25 12.4,2.4 9.6,4.6 36.6,20.8 32.6,24.8 39,15 47,19 45,26.4 13.8,37 13.8,40.2 13.95,44.1 8.8,31.2 17.35,46.5 19.55,46.9
  pour Top: 0,0 50,0 50,48 0,48
  pour Bottom: 0,0 50,0 50,48 0,48
GPIO0
  Top 0.3: R11.8 PIN15._ 21.02,18.82 IC1.2
GPIO1
  Top 0.3: R12.8 PIN16._ 24.27,19.32 IC1.7
GPIO2
  Top 0.3: R12.7 PIN17._ 26.23,18.23 IC1.10
GPIO3
  Top 0.3: R12.6 PIN18._ 26.88,18.32 IC1.11
GPIO4
  Top 0.3: R12.5 PIN19._ 27.52,18.48 IC1.12
GPIO5
  Top 0.3: R13.8 PIN24._ 30.4,20.4 28.8,22 27.4,22 25,24.4 21.6,24.4 21.02,24.98 IC1.27
GPIO6
  Top 0.3: IC1.26 21.68,25.12 21.8,25 25.2,25 27.6,22.6 29.4,22.6 31.2,20.8 PIN25._ R13.7
GPIO7
  Top 0.3: R13.6 PIN11._ 32,21.2 30,23.2 27.8,23.2 26.23,24.77 IC1.19
GPIO8
  Top 0.3: R13.5 PIN23._ 32.8,21.6 30.6,23.8 28,23.8 26.88,24.93 IC1.18
GPIO9
  Top 0.3: R14.8 PIN22._ 35.6,19.6 30.8,24.4 28.2,24.4 27.52,25.07 IC1.17
GPIO10
  Top 0.3: R14.7 PIN21._ 36.4,19.6 31,25 28.6,25 28.18,25.43 IC1.16
I2C_CLK  (via drill 0.6 pad 1)
  Top 0.3: R10.6 PIN31._ v17.8,19.4 | IC1.22 24.27,27.48 v24.8,28 26.2,29.4 31.6,29.4 38.2,22.8 40.25,22.8 R20.2 41.6,21.45 41.6,16.2 41.45,16.05 LS1.6
  Bottom 0.3: v17.8,19.4 27,19.4 28.6,21 28.6,24.2 v24.8,28
I2C_DATA  (via drill 0.6 pad 1)
  Top 0.3: R10.5 PIN30._ v18.6,18.2 | v23.6,29 23.62,27.98 IC1.23 | LS1.5 40.95,20.9 R19.2 39.75,22 | 39.75,22 39.8,22 | 39.75,22 37.95,22 32.35,27.6 v28.6,27.6
  Bottom 0.3: v18.6,18.2 19.2,18.8 27.2,18.8 29.2,20.8 29.2,24.4 27.2,26.4 | 27.2,26.4 26.2,27.4 26.2,28.4 25.6,29 v23.6,29 | v28.6,27.6 27.4,26.4 27.2,26.4
INT_JOLLA
  Top 0.3: IC1.15 32.55,26.05 37.6,21 39.8,21 40.2,20.6 40.2,14.2 42,12.4 43,12.4 43.6,13 43.6,14.2 42.2,15.6 42.2,19.2 43.4,20.4 R15.6
IR-R_CONT  (via drill 0.6 pad 1)
  Top 0.3: IC1.13 28.18,21.23 28,21.4 26.8,21.4 v26.4,21.8 | v16.8,39.6 16.8,40.4 17.4,41 17.4,44.8 17.75,45.15 NAND1.2
  Bottom 0.3: v26.4,21.8 26.4,23 24.4,25 22.8,25 16.8,31 v16.8,39.6
IR-T_CONT  (via drill 0.6 pad 1)
  Top 0.3: v15.8,38.6 15.8,40.6 16.8,41.6 16.8,45.2 16.35,45.65 NAND1.6 | v24.4,23.6 24.4,21.8 24.93,21.27 IC1.8
  Bottom 0.3: v24.4,23.6 23.6,24.4 22.6,24.4 15.8,31.2 v15.8,38.6
N$1
  Top 0.3: BC1.2 4.8,43.25 R2.1 3.7,43.45 R1.1
N$2
  Top 0.5: L1.2 7.5,39.7 5.8,41.4 5.2,41.4 4.8,41 BC1.5
N$4
  Top 0.3: R3.2 R4.2 R9.2 9.75,28.65 10.1,28.3 PGA1.2
N$6
  Top 0.3: IC1.14 28.8,20.32 28.8,20.2 29.6,19.4 PIN20._
N$7
  Top 0.3: R6.2 R7.2 R8.2 9.45,27.8 PGA1.3
N$8
  Top 0.3: D7.1 17.38,4.88 K1.8 17.38,13.82 16.6,14.6 R10.3
N$9
  Top 0.3: D7.6 18.65,3.65 K1.9 18.65,13.95 R10.4
N$10
  Top 0.3: D4.4 19.92,2.88 K1.10 19.92,14.72 R11.1
N$12
  Top 0.3: D4.1 22.75,7.46 K1.12 22.46,13.94 22,14.4 R11.3
N$13
  Top 0.3: D4.6 23.73,2.93 K1.13 23.73,14.27 R11.4
N$14
  Top 0.3: D5.4 24.6,3 24.6,7.35 K1.14 25,14.8 R12.1
N$15
  Top 0.3: D5.3 25.65,5.45 26.27,6.07 K1.15 26.2,12.32 R12.2
N$16
  Top 0.3: D5.1 K1.16 27.54,13.86 27,14.4 R12.3
N$17
  Top 0.3: IC1.21 24.93,26.93 PIN26._
N$18
  Top 0.3: LED1.A R17.2
N$19  (via drill 0.6 pad 1)
  Top 0.3: R15.3 R15.4 v46.8,21.2
  Bottom 0.3: v46.8,21.2 47.2,21.2 49,23 49,26 47.3,27.7 PIN5._
N$21
  Top 0.3: LS1.2 43.25,15.55 42.8,16 42.8,18.4 43.2,18.8 R15.8 R15.7 44.4,19.6 44.8,20 44.8,21.6 44.6,21.8 44.05,21.8 LED2.A 42.75,22.6 R16.1
N$24
  Top 0.3: D7.4 13.57,3.43 K1.5 13.57,13.77 R10.1
N$25
  Top 0.3: D7.3 14.84,4.66 K1.6 14.84,13.64 15.8,14.6 R10.2
N$26
  Top 0.3: D4.3 20.85,5.65 21.19,5.99 K1.11 R11.2
N$27
  Top 0.3: D5.6 28.81,3.21 K1.17 28.81,14.19 R12.4
N$28
  Top 0.3: D1.4 29.6,3 29.6,7.27 K1.18 30.08,14.88 R13.1
N$29
  Top 0.3: D1.3 30.65,5.45 31.35,6.15 K1.19 31.2,12.4 R13.2
N$30
  Top 0.3: D1.1 32.55,7.68 K1.20 32.62,13.98 32,14.6 R13.3
N$31
  Top 0.3: D1.6 33.89,3.29 K1.21 33.89,14.11 R13.4
N$32
  Top 0.3: D6.4 35.16,3.24 K1.22 35.16,15.96 R14.1
N$33
  Top 0.3: D6.3 36.43,4.47 K1.23 36.43,16.37 R14.2
N$34
  Top 0.3: PIN7._ R14.3
N$35
  Top 0.3: PIN8._ R14.4
N$36
  Top 0.3: PIN9._ R14.5
N$37
  Top 0.3: PIN10._ R14.6
N$38
  Top 0.3: NAND1.1 20.18,43.12 IR1.1
N$39
  Top 0.3: LED1.C 20.8,46.8 19.65,45.65 NAND1.3
N$40  (via drill 0.6 pad 1)
  Top 0.3: LS1.4 44.3,17 v45,17 44.8,17.2 44.8,19.2 45.2,19.6 R15.2
  Bottom 0.3: v45,17 45.2,17 45.2,16.9 PIN3._
N$42
  Top 0.3: LS1.7 LS1.8 41.4,15.05 R18.2
N$43  (via drill 0.6 pad 1)
  Top 0.3: v46.4,15.6 45,15.6 | 45,15.6 44.55,16.05 LS1.3 | 45,15.6 46.4,17 46.4,18 R15.1
  Bottom 0.3: PIN4._ 46.4,12.3 | 46.4,12.3 46.4,12.2 | 46.4,12.3 v46.4,15.6
RST  (via drill 0.6 pad 1)
  Top 0.3: R10.8 PIN29._ 15,19.4 v16.2,20.6 | IC1.24 22.98,27.23 v22.8,27.4 22.8,27.6 21.4,29 20.3,29 C6.2 19.95,28.55 R5.2
  Bottom 0.3: v16.2,20.6 16.8,21.2 18.6,21.2 19.2,20.6 26.6,20.6 27.4,21.4 27.4,23.4 24.8,26 24.2,26 v22.8,27.4
SENS+
  Top 0.3: K1.2 7.45,7.75 4,11.2 4,28.6 5.55,30.15 R3.1
SENS-
  Top 0.3: K1.1 8.49,13.71 6.6,15.6 R6.1
SPI_SIMO  (via drill 0.6, 0.6 pad 1)
  Top 0.3: R11.6 PIN12._ 22.32,18.52 IC1.4 22.32,21.68 21.6,22.4 18.4,22.4 17,23.8 17,26.6 15.8,27.8 PGA1.8 14.2,27.8 13.8,28.2 13.8,29.2 14.4,29.8 14.4,31.6 12.6,33.4 12.6,34 13.4,34.8 v13.4,35.2 | v13,39.2 13,41.2 13.4,41.6 13.4,43 13,43.4 13,44.4 14.75,46.15 NAND1.5
  Bottom 0.3: v13.4,35.2 12.8,35.8 12.8,39 v13,39.2
SPI_SOMI  (via drill 0.6 pad 1)
  Top 0.3: R11.7 PIN13._ 21.68,18.68 IC1.3 21.68,21.52 21.4,21.8 18,21.8 15.6,24.2 15,24.2 v14.2,25 | NAND1.7 14.95,45.15 14.8,45 v14.8,41
  Bottom 0.3: v14.2,25 14.8,25.6 v14.8,41
SPICLK  (via drill 0.6 pad 1)
  Top 0.3: R11.5 PIN14._ 23.62,19.02 IC1.6 23.62,22.98 22.8,23.8 v18.6,23.8 | v15.6,25.2 16,25.6 16,26.8 15.5,27.3 PGA1.7
  Bottom 0.3: v18.6,23.8 18,23.8 16.6,25.2 v15.6,25.2
TST  (via drill 0.6 pad 1)
  Top 0.3: R10.7 PIN28._ 15.8,18.8 v16.2,19.2 | v21.2,27.8 22.32,26.68 IC1.25
  Bottom 0.3: v16.2,19.2 17.4,20.4 18.2,20.4 18.6,20 26.8,20 28,21.2 28,23.6 25,26.6 24.8,26.6 23.2,28.2 21.6,28.2 v21.2,27.8
VAD_SENSE  (via drill 0.6 pad 1)
  Top 0.3: IC1.5 22.98,22.23 v22.4,22.8 | v15.6,22.8 15.2,22.8 11.2,26.8 PGA1.5
  Bottom 0.3: v22.4,22.8 v15.6,22.8